# Altium project SL1 Xilinx Spartan-IIE PQ208 Rev1.02.PrjPcb
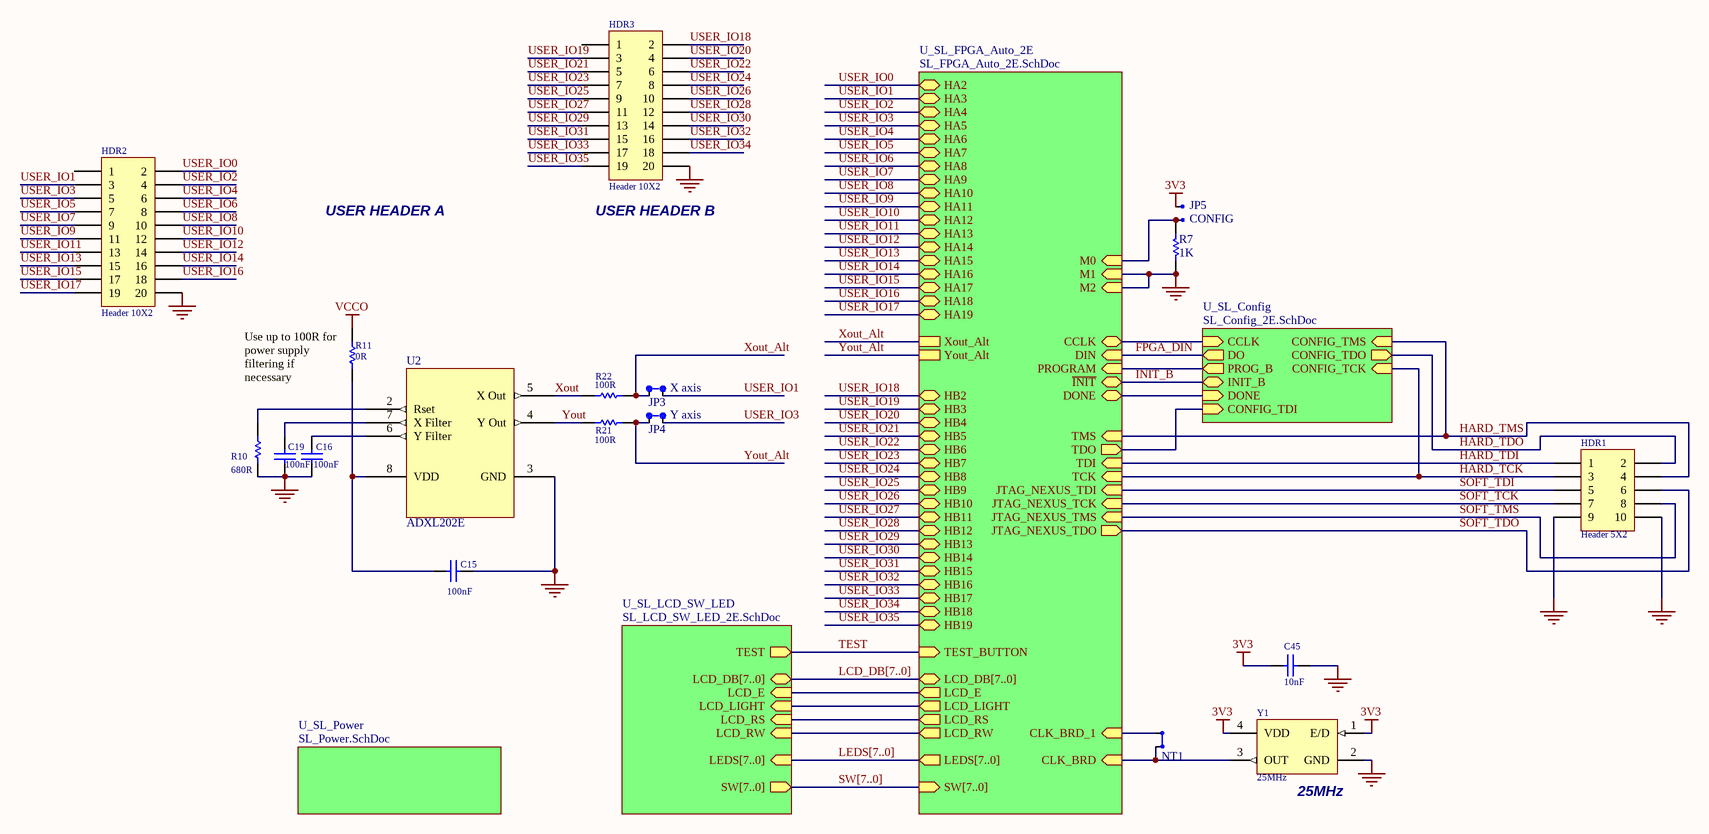
[diagram p0: SL1 Xilinx Spartan-IIE PQ208 Rev1.02.SchDoc]
2 sheets, 48 parts. Net scope: hierarchical (ports join the sheet entries above them; power ports are global).
Board file: SL1 Xilinx Spartan-IIE PQ208 Rev1.02.PcbDoc
Sheets:
  SL1 Xilinx Spartan-IIE PQ208 Rev1.02.SchDoc
    U_SL_LCD_SW_LED = SL_LCD_SW_LED_2E.SchDoc

## Sheet SL1 Xilinx Spartan-IIE PQ208 Rev1.02.SchDoc: Spirit Level - Spartan 2E
size B; Organization: Altium Limited; Address1: L3, 12a Rodborough Rd; Address2: Frenchs Forest; Address3: NSW; Address4: Australia 2086; DocumentNumber: 5; SheetNumber: 5; SheetTotal: 5; Library Name: SpiritLevel_2E.SchLib

### Parts
C15  100nF  [CC1608-0603]
C16  100nF  [CC1608-0603]
C19  100nF  [CC1608-0603]
C45  10nF  [CC1608-0603]
HDR1  Header 5X2  [HDR2X5_LP]
HDR2  Header 10X2  [HDR2X10]
HDR3  Header 10X2  [HDR2X10]
JP3  X axis  [HDR1X2]
JP4  Y axis  [HDR1X2]
JP5  CONFIG  [HDR1X2]
JS2  Short Linking  (value not drawn)  (mechanical)
JS3  Shorting Link  (value not drawn)  (mechanical)
NT1  GND  [NT]  (value not drawn)  (net tie, no BOM)
R7  1K  [CR2012-0805]
R10  680R  [CR2012-0805]
R11  0R  [CR2012-0805]
R21  100R  [CR2012-0805]
R22  100R  [CR2012-0805]
U2  ADXL202E  [E-8]
Y1  25MHz  [QSMO_4200]

### Sub-sheets
U_SL_Config = SL_Config_2E.SchDoc (file not in this document): PROG_B (out), CONFIG_TDO (out), DO (out), CCLK (in), CONFIG_TDI (in), CONFIG_TCK (in), CONFIG_TMS (in), INIT_B (bidir), DONE (in)
U_SL_FPGA_Auto_2E = SL_FPGA_Auto_2E.SchDoc (file not in this document): CLK_BRD (in), HA10 (bidir), HA11 (bidir), HA12 (bidir), HA13 (bidir), HA14 (bidir), HA15 (bidir), HA16 (bidir), HA17 (bidir), HA18 (bidir), HA19 (bidir), HA2 (bidir), HA3 (bidir), HA4 (bidir), HA5 (bidir), HA6 (bidir), HA7 (bidir), HA8 (bidir), HA9 (bidir), HB10 (bidir), HB11 (bidir), HB12 (bidir), HB13 (bidir), HB14 (bidir), HB15 (bidir), HB16 (bidir), HB17 (bidir), HB18 (bidir), HB19 (bidir), HB2 (bidir), HB3 (bidir), HB4 (bidir), HB5 (bidir), HB6 (bidir), HB7 (bidir), HB8 (bidir), HB9 (bidir), JTAG_NEXUS_TCK (in), JTAG_NEXUS_TDI (in), JTAG_NEXUS_TDO (out), JTAG_NEXUS_TMS (in), LCD_DB[7..0] (bidir), LCD_E (out), LCD_LIGHT (out), LCD_RS (out), LCD_RW (out), LEDS[7..0] (out), SW[7..0] (in), TEST_BUTTON (in), CCLK (bidir), DONE (bidir), M0 (in), M1 (in), M2 (in), PROGRAM (in), TCK (in), TDI (in), TDO (out), TMS (in), DIN (in), ~{INIT} (bidir), CLK_BRD_1 (in), Xout_Alt, Yout_Alt
U_SL_LCD_SW_LED = SL_LCD_SW_LED_2E.SchDoc: TEST (out), SW[7..0] (out), LCD_DB[7..0] (bidir), LCD_E (in), LCD_RS (in), LCD_RW (in), LCD_LIGHT (in), LEDS[7..0] (in)
U_SL_Power = SL_Power.SchDoc (file not in this document): no entries

### Nets
3V3: C45.1 JP5.2 Y1.1(E/D) Y1.4(VDD)
GND: C15.2 C16.2 C19.2 C45.2 HDR1.9 HDR1.10 HDR2.20 HDR3.20 R7.1 R10.1 U2.3(GND) Y1.2(GND) ; sheet U_SL_FPGA_Auto_2E/M1, sheet U_SL_FPGA_Auto_2E/M2
VCCO: R11.1
FPGA_DIN: sheet U_SL_Config/DO, sheet U_SL_FPGA_Auto_2E/DIN
HARD_TCK: HDR1.3 ; sheet U_SL_Config/CONFIG_TCK, sheet U_SL_FPGA_Auto_2E/TCK
HARD_TDI: HDR1.1 ; sheet U_SL_FPGA_Auto_2E/TDI
HARD_TDO: HDR1.2 ; sheet U_SL_Config/CONFIG_TDO
HARD_TMS: HDR1.4 ; sheet U_SL_Config/CONFIG_TMS, sheet U_SL_FPGA_Auto_2E/TMS
INIT_B: sheet U_SL_Config/INIT_B, sheet U_SL_FPGA_Auto_2E/~{INIT}
LCD_E: sheet U_SL_LCD_SW_LED/LCD_E, sheet U_SL_FPGA_Auto_2E/LCD_E
LCD_LIGHT: sheet U_SL_LCD_SW_LED/LCD_LIGHT, sheet U_SL_FPGA_Auto_2E/LCD_LIGHT
LCD_RS: sheet U_SL_LCD_SW_LED/LCD_RS, sheet U_SL_FPGA_Auto_2E/LCD_RS
LCD_RW: sheet U_SL_LCD_SW_LED/LCD_RW, sheet U_SL_FPGA_Auto_2E/LCD_RW
SOFT_TCK: HDR1.7 ; sheet U_SL_FPGA_Auto_2E/JTAG_NEXUS_TCK
SOFT_TDI: HDR1.5 ; sheet U_SL_FPGA_Auto_2E/JTAG_NEXUS_TDI
SOFT_TDO: HDR1.6 ; sheet U_SL_FPGA_Auto_2E/JTAG_NEXUS_TDO
SOFT_TMS: HDR1.8 ; sheet U_SL_FPGA_Auto_2E/JTAG_NEXUS_TMS
TEST: sheet U_SL_LCD_SW_LED/TEST, sheet U_SL_FPGA_Auto_2E/TEST_BUTTON
USER_IO0: HDR2.2 ; sheet U_SL_FPGA_Auto_2E/HA2
USER_IO1: HDR2.3 JP3.2 ; sheet U_SL_FPGA_Auto_2E/HA3
USER_IO2: HDR2.4 ; sheet U_SL_FPGA_Auto_2E/HA4
USER_IO3: HDR2.5 JP4.2 ; sheet U_SL_FPGA_Auto_2E/HA5
USER_IO4: HDR2.6 ; sheet U_SL_FPGA_Auto_2E/HA6
USER_IO5: HDR2.7 ; sheet U_SL_FPGA_Auto_2E/HA7
USER_IO6: HDR2.8 ; sheet U_SL_FPGA_Auto_2E/HA8
USER_IO7: HDR2.9 ; sheet U_SL_FPGA_Auto_2E/HA9
USER_IO8: HDR2.10 ; sheet U_SL_FPGA_Auto_2E/HA10
USER_IO9: HDR2.11 ; sheet U_SL_FPGA_Auto_2E/HA11
USER_IO10: HDR2.12 ; sheet U_SL_FPGA_Auto_2E/HA12
USER_IO11: HDR2.13 ; sheet U_SL_FPGA_Auto_2E/HA13
USER_IO12: HDR2.14 ; sheet U_SL_FPGA_Auto_2E/HA14
USER_IO13: HDR2.15 ; sheet U_SL_FPGA_Auto_2E/HA15
USER_IO14: HDR2.16 ; sheet U_SL_FPGA_Auto_2E/HA16
USER_IO15: HDR2.17 ; sheet U_SL_FPGA_Auto_2E/HA17
USER_IO16: HDR2.18 ; sheet U_SL_FPGA_Auto_2E/HA18
USER_IO17: HDR2.19 ; sheet U_SL_FPGA_Auto_2E/HA19
USER_IO18: HDR3.2 ; sheet U_SL_FPGA_Auto_2E/HB2
USER_IO19: HDR3.3 ; sheet U_SL_FPGA_Auto_2E/HB3
USER_IO20: HDR3.4 ; sheet U_SL_FPGA_Auto_2E/HB4
USER_IO21: HDR3.5 ; sheet U_SL_FPGA_Auto_2E/HB5
USER_IO22: HDR3.6 ; sheet U_SL_FPGA_Auto_2E/HB6
USER_IO23: HDR3.7 ; sheet U_SL_FPGA_Auto_2E/HB7
USER_IO24: HDR3.8 ; sheet U_SL_FPGA_Auto_2E/HB8
USER_IO25: HDR3.9 ; sheet U_SL_FPGA_Auto_2E/HB9
USER_IO26: HDR3.10 ; sheet U_SL_FPGA_Auto_2E/HB10
USER_IO27: HDR3.11 ; sheet U_SL_FPGA_Auto_2E/HB11
USER_IO28: HDR3.12 ; sheet U_SL_FPGA_Auto_2E/HB12
USER_IO29: HDR3.13 ; sheet U_SL_FPGA_Auto_2E/HB13
USER_IO30: HDR3.14 ; sheet U_SL_FPGA_Auto_2E/HB14
USER_IO31: HDR3.15 ; sheet U_SL_FPGA_Auto_2E/HB15
USER_IO32: HDR3.16 ; sheet U_SL_FPGA_Auto_2E/HB16
USER_IO33: HDR3.17 ; sheet U_SL_FPGA_Auto_2E/HB17
USER_IO34: HDR3.18 ; sheet U_SL_FPGA_Auto_2E/HB18
USER_IO35: HDR3.19 ; sheet U_SL_FPGA_Auto_2E/HB19
Xout: R22.2 U2.5(X_Out)
Xout_Alt: JP3.1 R22.1 ; sheet U_SL_FPGA_Auto_2E/Xout_Alt
Yout: R21.2 U2.4(Y_Out)
Yout_Alt: JP4.1 R21.1 ; sheet U_SL_FPGA_Auto_2E/Yout_Alt
NetC15_1: C15.1 R11.2 U2.8(VDD)
NetC16_1: C16.1 U2.6(Y_Filter)
NetC19_1: C19.1 U2.7(X_Filter)
NetJP5_1: JP5.1 R7.2 ; sheet U_SL_FPGA_Auto_2E/M0
NetNT1_1: NT1.1 ; sheet U_SL_FPGA_Auto_2E/CLK_BRD_1
NetNT1_2: NT1.2 Y1.3(OUT) ; sheet U_SL_FPGA_Auto_2E/CLK_BRD
NetR10_2: R10.2 U2.2(Rset)
(unnamed): sheet U_SL_Config/PROG_B, sheet U_SL_FPGA_Auto_2E/PROGRAM
(unnamed): sheet U_SL_Config/CCLK, sheet U_SL_FPGA_Auto_2E/CCLK
(unnamed): sheet U_SL_Config/CONFIG_TDI, sheet U_SL_FPGA_Auto_2E/TDO
(unnamed): sheet U_SL_Config/DONE, sheet U_SL_FPGA_Auto_2E/DONE

Not connected (* = marked no-connect by the designer): HDR2 1; HDR3 1; U2 1(Self_Test)

### Buses and harness runs
bus LCD_DB[7..0] = sheet U_SL_FPGA_Auto_2E/LCD_DB[7..0] = sheet U_SL_LCD_SW_LED/LCD_DB[7..0]
bus LEDS[7..0] = sheet U_SL_FPGA_Auto_2E/LEDS[7..0] = sheet U_SL_LCD_SW_LED/LEDS[7..0]
bus SW[7..0] = sheet U_SL_FPGA_Auto_2E/SW[7..0] = sheet U_SL_LCD_SW_LED/SW[7..0]

### Notes on the sheet
- USER HEADER A
- (near HDR3) USER HEADER B
- (near R11) Use up to 100R for power supply filtering if necessary
- (near Y1) 25MHz
- Title
- Size:
- Date:
- B
- Number:
- Time:
- Revision:
- Sheet
- of
- File:

### Library data of the parts
C15 C16 C19 = CAP: Capacitor; AEMS Code: 2101550
C45 = CAP: Capacitor; AEMS Code: 2100341
HDR1 = Header 5X2: Header, 5-Pin, Dual row; Revision: 17-Jul-2002: Re-released for DXP Platform.
HDR2 HDR3 = Header 10X2: Header, 10-Pin, Dual row; Revision: July-2002: Re-released for DXP Platform.
JP3-JP5 = Jumper, 2-Pin
JS2 JS3 = Jumper Socket: Shorting Link, 2.54mm (0.1") Pitch
NT1 = Jumper, 2-Pin_1: Jumper, 2-Pin
R7 = RES: Resistor; AEMS Code: 1200008JN
R10 = Res1: Resistor; AEMS Code: CHANGED VALUE; Revision: July-2002: Re-released for DXP Platform.
R11 = RES: Resistor; AEMS Code: 1200075
R21 R22 = Res1: Resistor; AEMS Code: 1200012JT; Revision: July-2002: Re-released for DXP Platform.
U2 = ADXL202E: Accelerometer with Digital Output
Y1 = QSMO_4200: Surface Mount Crystal Oscillator

## Sheet SL_LCD_SW_LED_2E.SchDoc: LCD, Switches and LEDs
size B; Organization: Altium Limited; Address1: L3, 12a Rodborough Rd; Address2: Frenchs Forest; Address3: NSW; Address4: Australia 2086; DocumentNumber: 3; SheetNumber: 3; SheetTotal: 5; Library Name: SpiritLevel_2E.SchLib
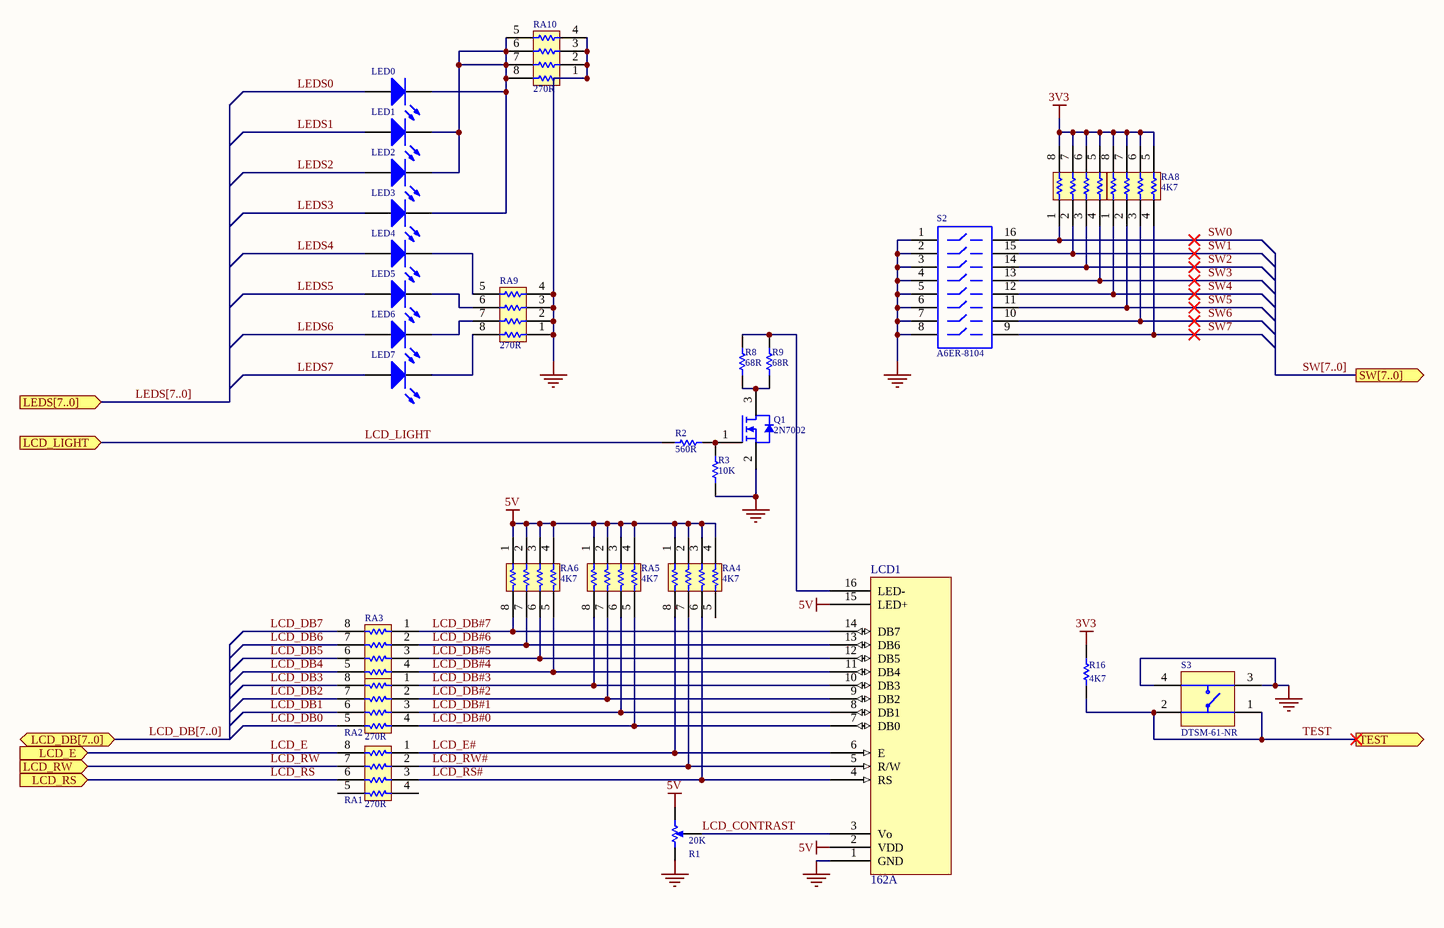
[diagram p1: SL_LCD_SW_LED_2E.SchDoc]

### Parts
LCD1  162A  [162A]
LED0  HSMH-C170  [SMD _LED]  (value not drawn)
LED1  HSMH-C170  [SMD _LED]  (value not drawn)
LED2  HSMH-C170  [SMD _LED]  (value not drawn)
LED3  HSMH-C170  [SMD _LED]  (value not drawn)
LED4  HSMH-C170  [SMD _LED]  (value not drawn)
LED5  HSMH-C170  [SMD _LED]  (value not drawn)
LED6  HSMH-C170  [SMD _LED]  (value not drawn)
LED7  HSMH-C170  [SMD _LED]  (value not drawn)
Q1  2N7002  [SO-G3]
R1  20K  [POT4MM-2]
R2  560R  [CC2012-0805]
R3  10K  [CC2012-0805]
R8  68R  [CC2012-0805]
R9  68R  [CC2012-0805]
R16  4K7  [CC2012-0805]
RA1  270R  [MNR34]
RA2  270R  [MNR34]
RA3  270R  [MNR34]
RA4  4K7  [MNR34T]
RA5  4K7  [MNR34T]
RA6  4K7  [MNR34T]
RA7  4K7  [MNR34T]
RA8  4K7  [MNR34T]
RA9  270R  [MNR34T]
RA10  270R  [MNR34T]
S2  A6ER-8104  [DIP-16-KEY]
S3  DTSM-61-NR  [B3FS_SWITCH]

### Ports
LCD_DB[7..0] (bidir), LCD_E (in), LCD_LIGHT (in), LCD_RS (in), LCD_RW (in), LEDS[7..0] (in), SW[7..0] (out), TEST (out)

### Nets
3V3: R16.1 RA7.5 RA7.6 RA7.7 RA7.8 RA8.5 RA8.6 RA8.7 RA8.8
5V: LCD1.2(VDD) LCD1.15(LED+) R1.CW(+) RA4.1 RA4.2 RA4.3 RA4.4 RA5.1 RA5.2 RA5.3 RA5.4 RA6.1 RA6.2 RA6.3 RA6.4
GND: LCD1.1(GND) Q1.2 R1.CCW(-) R3.1 RA9.1 RA9.2 RA9.3 RA9.4 RA10.1 RA10.2 RA10.3 RA10.4 S2.1 S2.2 S2.3 S2.4 S2.5 S2.6 S2.7 S2.8 S3.3 S3.4
LCD_CONTRAST: LCD1.3(Vo) R1.W
LCD_DB0: RA2.5
LCD_DB1: RA2.6
LCD_DB2: RA2.7
LCD_DB3: RA2.8
LCD_DB4: RA3.5
LCD_DB5: RA3.6
LCD_DB6: RA3.7
LCD_DB7: RA3.8
LCD_DB#0: LCD1.7(DB0) RA2.4 RA5.5
LCD_DB#1: LCD1.8(DB1) RA2.3 RA5.6
LCD_DB#2: LCD1.9(DB2) RA2.2 RA5.7
LCD_DB#3: LCD1.10(DB3) RA2.1 RA5.8
LCD_DB#4: LCD1.11(DB4) RA3.4 RA6.5
LCD_DB#5: LCD1.12(DB5) RA3.3 RA6.6
LCD_DB#6: LCD1.13(DB6) RA3.2 RA6.7
LCD_DB#7: LCD1.14(DB7) RA3.1 RA6.8
LCD_E: RA1.8 ; port LCD_E
LCD_E#: LCD1.6(E) RA1.1 RA4.8
LCD_LIGHT: R2.1 ; port LCD_LIGHT
LCD_RS: RA1.6 ; port LCD_RS
LCD_RS#: LCD1.4(RS) RA1.3 RA4.6
LCD_RW: RA1.7 ; port LCD_RW
LCD_RW#: LCD1.5(R/W) RA1.2 RA4.7
LEDS0: LED0.1(A)
LEDS1: LED1.1(A)
LEDS2: LED2.1(A)
LEDS3: LED3.1(A)
LEDS4: LED4.1(A)
LEDS5: LED5.1(A)
LEDS6: LED6.1(A)
LEDS7: LED7.1(A)
SW0: RA7.1 S2.16
SW1: RA7.2 S2.15
SW2: RA7.3 S2.14
SW3: RA7.4 S2.13
SW4: RA8.1 S2.12
SW5: RA8.2 S2.11
SW6: RA8.3 S2.10
SW7: RA8.4 S2.9
TEST: R16.2 S3.1 S3.2 ; port TEST
NetLCD1_16: LCD1.16(LED-) R8.1 R9.1
NetLED0_2: LED0.2(K) LED1.2(K) LED2.2(K) LED3.2(K) RA10.5 RA10.6 RA10.7 RA10.8
NetLED4_2: LED4.2(K) RA9.5
NetLED5_2: LED5.2(K) RA9.6
NetLED6_2: LED6.2(K) RA9.7
NetLED7_2: LED7.2(K) RA9.8
NetQ1_1: Q1.1 R2.2 R3.2
NetQ1_3: Q1.3 R8.2 R9.2

Not connected (* = marked no-connect by the designer): RA1 4 5; RA4 5

### Buses and harness runs
bus LCD_DB[7..0] = port LCD_DB[7..0]
bus LEDS[7..0] = port LEDS[7..0]
bus SW[7..0] = port SW[7..0]

### Notes on the sheet
- Title
- Size:
- Date:
- B
- Number:
- Time:
- Revision:
- Sheet
- of
- File:

### Library data of the parts
LCD1 = 162A: 16 char * 2 line LCD character display with b/light
LED0-LED7 = HSMX-C670: Typical RED GaAs SMD LED Agilent make; AEMS Code: 2610081; Revision: July-2002: Re-released for DXP Platform.
Q1 = 2N7002: N Channel Mosfet
R1 = RPot SM: Square Trimming Potentiometer; AEMS Code: 1400226
R2 = RES: Resistor; AEMS Code: 1200723
R3 = RES: Resistor; AEMS Code: 1200006JT
R8 R9 = RES: Resistor; AEMS Code: 1200821
R16 = RES: Resistor; AEMS Code: 1200226
RA1-RA3 RA9 RA10 = MNR34: 3216x4 Resistor Array; AEMS Code: 1310010
RA4-RA8 = MNR34: 3216x4 Resistor Array; AEMS Code: 1300330
S2 = A6ER-8104: DIP Switch Side actuator long liver Piano Key; Revision: July-2002: Re-released for DXP Platform.
S3 = B3FS: SPNA SMD Keyboard Switch

## Nets that join several sheets
3V3: SL1 Xilinx Spartan-IIE PQ208 Rev1.02 (C45.1 JP5.2 Y1.1 Y1.4), SL_LCD_SW_LED_2E (9 pins)
GND: SL1 Xilinx Spartan-IIE PQ208 Rev1.02 (12 pins), SL_LCD_SW_LED_2E (22 pins)